# Altium schematic sheet 06_iMX 8X_CAN.SchDoc
size A4; SheetNumber: 7; SheetTotal: 24
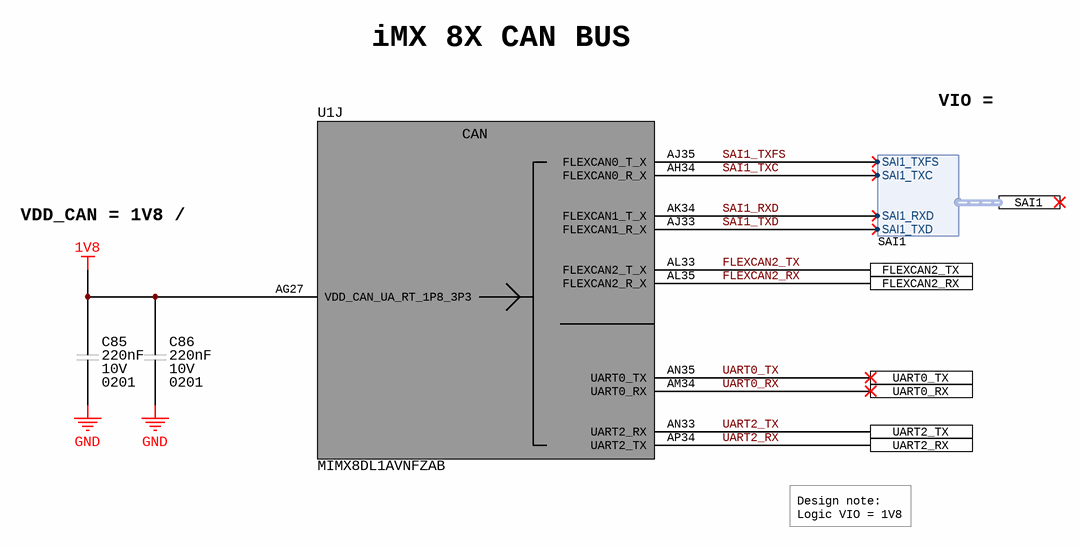
[diagram p0: 06_iMX 8X_CAN.SchDoc]

## Parts
C85  Voltage Rating (DC): 10V  Capacitance: 220nF  Case/Package: 0201  [CAP_0201_CAPC0603X03N]  (hidden comment: LMK063BJ224MP-F)
C86  Voltage Rating (DC): 10V  Capacitance: 220nF  Case/Package: 0201  [CAP_0201_CAPC0603X03N]  (hidden comment: LMK063BJ224MP-F)
U1  MIMX8DL1AVNFZAB  [MIMX8DL1AVNFZAB]  (part J of 15)

## Ports
FLEXCAN2_RX, FLEXCAN2_TX, SAI1 (harness SAI1), UART0_RX, UART0_TX, UART2_RX, UART2_TX

## Harnesses
SAI1: SAI1_TXFS, SAI1_TXC, SAI1_RXD, SAI1_TXD

## Nets
1V8: C85.2 C86.2 U1.AG27(VDD_CAN_UA_RT_1P8_3P3)
GND: C85.1 C86.1
FLEXCAN2_RX: U1.AL35(FLEXCAN2_R_X) ; port FLEXCAN2_RX
FLEXCAN2_TX: U1.AL33(FLEXCAN2_T_X) ; port FLEXCAN2_TX
SAI1_RXD: U1.AK34(FLEXCAN1_T_X) ; port SAI1.SAI1_RXD
SAI1_TXC: U1.AH34(FLEXCAN0_R_X) ; port SAI1.SAI1_TXC
SAI1_TXD: U1.AJ33(FLEXCAN1_R_X) ; port SAI1.SAI1_TXD
SAI1_TXFS: U1.AJ35(FLEXCAN0_T_X) ; port SAI1.SAI1_TXFS
UART0_RX: U1.AM34(UART0_RX) ; port UART0_RX
UART0_TX: U1.AN35(UART0_TX) ; port UART0_TX
UART2_RX: U1.AP34(UART2_TX) ; port UART2_RX
UART2_TX: U1.AN33(UART2_RX) ; port UART2_TX

## Notes on the sheet
- iMX 8X CAN BUS
- VIO = 1V8
- VDD_CAN = 1V8 / 2.5A
- Design note:
  Logic VIO = 1V8
- PCB Des :
- Approv By :
- Project Title :
- Sheet Title :
- Date :
- PCB Version :
- Size :
- A4
- Page :
- PCB Revision :
- (in symbol IC_MPU_ARM_1.2GHz_MIMX8DL1AVNFZAB, part J) CAN

## Library data of the parts
C85 C86 = CAP_0.22UF_10V_X5R_0201: Multilayer Ceramic Capacitors (High dielectric type), 10V, 0.22 uF, ± 20 %, 0201, X5R, RoHS; Manufacturer: Taiyo Yuden; Material: 4241ConductorMaterial; Tolerance: 20%; Supplier 1: Digikey; Manufacturer Part Number: LMK063BJ224MP-F; RoHS: Yes; Category: Ceramic Capacitors; Stock 1: 6053224; Pricing 1: 1=0.12, 10=0.08, 50=0.0478, 100=0.0375, 500=0.02772, 1000=0.02295, 2500=0.02136, 5000=0.01954 (USD); Mount: Surface Mount; Case Code (Metric): 0603; Case Code (Imperial): 0201; Min Operating Temperature: -55°C; Max Operating Temperature: 85°C; Voltage Rating: 10V; Packaging: Tape and Reel; Package Quantity: 15000; Dielectric: X5R; Termination: SMD/SMT; Voltage: 10V; Series: M; Construction: Flat; Length: 0.6mm; Width: 0.3mm; Height: 0.3mm; Depth: 0.3mm; Radiation Hardening: No; Halogen Free: Halogen Free; RoHS Compliant: Yes; Reach SVHC Compliant: Unknown; ComponentLink1URL: https://datasheet.ciiva.com/134/lmk063bj224mp-f-ss-134995.pdf?src-supplier=Digikey; ComponentLink1Description: https://datasheet.ciiva.com/134/lmk063bj224mp-f-ss-134995.pdf?src-supplier=Digikey; ComponentLink2URL: https://datasheet.ciiva.com/11464/lmk063bj224mp-f-ss-11464053.pdf?src-supplier=Avnet; ComponentLink2Description: https://datasheet.ciiva.com/11464/lmk063bj224mp-f-ss-11464053.pdf?src-supplier=Avnet; ComponentLink3URL: https://datasheet.ciiva.com/15921/1589lmk063bj224mp-f-15921250.pdf?src-supplier=Onlinecomponents.com; ComponentLink3Description: https://datasheet.ciiva.com/15921/1589lmk063bj224mp-f-15921250.pdf?src-supplier=Onlinecomponents.com; ComponentLink4URL: https://datasheet.ciiva.com/26872/getdatasheetpartid-639019-26872592.pdf?src-supplier=Verical; ComponentLink4Description: https://datasheet.ciiva.com/26872/getdatasheetpartid-639019-26872592.pdf?src-supplier=Verical; ComponentLink5URL: https://datasheet.ciiva.com/30243/100lmk063bj224mp-f-30243150.pdf?src-supplier=Onlinecomponents.com; ComponentLink5Description: https://datasheet.ciiva.com/30243/100lmk063bj224mp-f-30243150.pdf?src-supplier=Onlinecomponents.com; ComponentLink6URL: https://datasheet.ciiva.com/28645/746258-28645141.pdf?src-supplier=Element14; ComponentLink6Description: https://datasheet.ciiva.com/28645/746258-28645141.pdf?src-supplier=Element14; ComponentLink7URL: https://datasheet.ciiva.com/5422/mlcc-all-e-541559-5422365.pdf?src-supplier=Mouser; ComponentLink7Description: https://datasheet.ciiva.com/5422/mlcc-all-e-541559-5422365.pdf?src-supplier=Mouser; Supplier Part Number 1: 587-2483-1-ND
U1 = IC_MPU_ARM_1.2GHz_MIMX8DL1AVNFZAB: I.MX8 Dxl 15SQ / Tray Rohs Compliant: Yes; Manufacturer: NXP Semiconductors; Supplier 1: Mouser; Manufacturer Part Number: MIMX8DL1AVNFZAB; RoHS: No; Category: Uncategorized; Stock 1: 196; Pricing 1: 1=46.19, 10=40.26, 25=38.57, 50=38.56, 100=33.3, 252=33.16, 1000=33.3, 10000=33.3 (USD); Supplier Part Number 1: 771-MIMX8DL1AVNFZAB